# Altium schematic sheet Sch.SchDoc
size A4
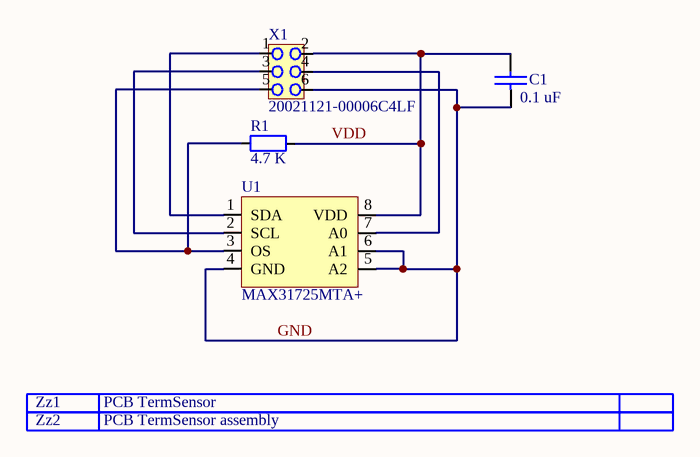
[diagram p0: Sch.SchDoc]

## Parts
C1  value 0.1 uF  [1608[0603]]  (hidden comment: CL10B104KA8NNND)
R1  value 4.7 K  [0603]  (hidden comment: RJ0603FRE074K7L)
U1  MAX31725MTA+  [T833-2 Maxim]
X1  20021121-00006C4LF  [FCI_20021121-00006XXLFc]
Zz1  PCB TermSensor
Zz2  PCB TermSensor assembly

## Nets
GND: C1.1 U1.4(GND) U1.5(A2) U1.6(A1) X1.6
VDD: C1.2 R1.2 U1.8(VDD) X1.2
NetR1_1: R1.1 U1.3(OS) X1.5
NetU1_1: U1.1(SDA) X1.1
NetU1_2: U1.2(SCL) X1.3
NetU1_7: U1.7(A0) X1.4

## Library data of the parts
C1 = CVNF100K0603-25: 0.1 uF, 25V, 10% , X7R,  0603 SMD MLC Capacitor; Manufacturer: SAMSUNG; Tolerance: 10%; Distributor: Future; Price: 0.0026 Euro; Voltage: 25 V; PartNum: CL10B104KA8NNND; PartName: CL10B104KA8NNND; Price50: 0.0026 Euro; Price100: 0.0026 Euro; Price1000: 0.0026 Euro
R1 = RL0603K004.7-1_1: 4.7 K, 1%, 0603, SMD Resistor, Taped; Manufacturer: YAGEO AMERICA CORPORATION; Voltage: 75 V; Distributor: Future; Price: 0.0017$; Tolerance: 1%; PartNum: RJ0603FRE074K7L; PartName: RJ0603FRE074K7L; Price50: 0.0017$; Price100: 0.0017$; Price1000: 0.0017$
U1 = MAX31725MTA+: IC TEMP SENSOR 8-TDFN; Manufacturer: Maxim Integrated; PartNum: MAX31725MTA+-ND; Price: 3.21$; Distributor: Digi-Key
X1 = 20021121-00006C4LF: Pin header 2X3, 1.27 mm pitch, SMD; Manufacturer: FCI; PartNum: 1865277; Distributor: Farnell; Price: 2.35; PartName: 20021121-00006C4LF
Zz1 = BOM item: Manufacturer: Brandner; PartNum: PCB TermSensor board; PartName: PCB TermSensor; Price: 1 Euro
Zz2 = BOM item: Manufacturer: ESEMDA; PartName: PCB TermSensor assembly; PartNum: PCB TermSensor assembly; Price: 30